# EAGLE design max30105 (EAGLE 7.7.0)
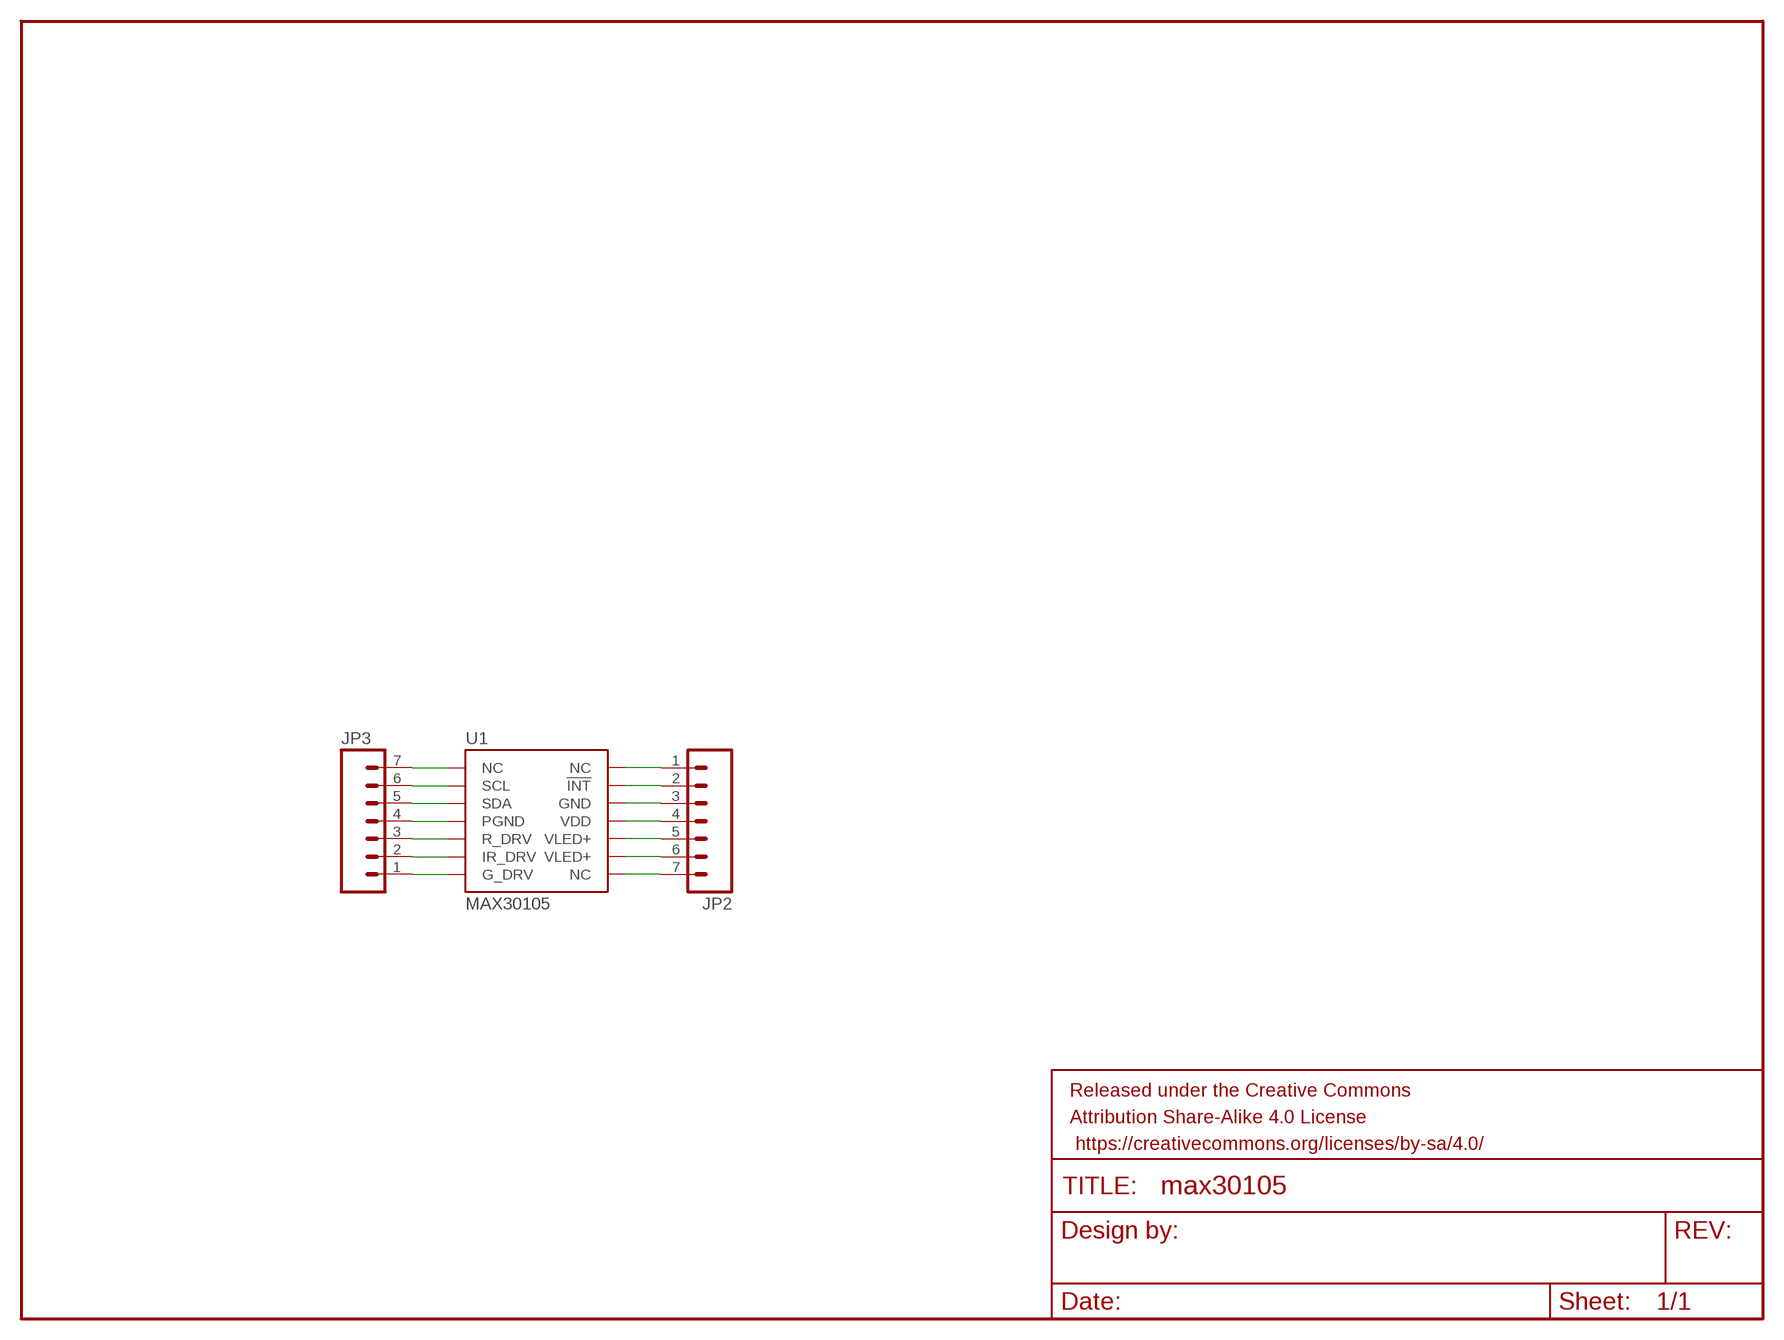
[diagram p0: schematic, sheet 1]

## Parts
FRAME1  FRAME-LETTER  [CREATIVE_COMMONS]
JP2  M07  [1X07]
JP3  M07  [1X07]
U1  MAX30105  MAX30105SMD  [OLGA-14]

## Nets
N$1: JP2.1 U1.14(NC)
N$2: JP2.2 U1.13(!INT)
N$3: JP2.3 U1.12(GND)
N$4: JP2.4 U1.11(VDD)
N$5: JP2.5 U1.10(VLED+)
N$6: JP2.6 U1.9(VLED+)
N$7: JP2.7 U1.8(NC)
N$8: JP3.1 U1.7(G_DRV)
N$9: JP3.2 U1.6(IR_DRV)
N$10: JP3.3 U1.5(R_DRV)
N$11: JP3.4 U1.4(PGND)
N$12: JP3.5 U1.3(SDA)
N$13: JP3.6 U1.2(SCL)
N$14: JP3.7 U1.1(NC)

## Library data of the parts
FRAME1 = SparkFun-Aesthetics:FRAME-LETTER: Schematic Frame Standard 8.5x11 US Letter frame
JP2 JP3 = SparkFun-Connectors:M07: Header 7 Standard 7-pin 0.1" header. Use with straight break away headers (SKU : PRT-00116), right angle break away headers (PRT-00553), swiss pins (PRT-00743), machine pins (PRT-00117), and female headers (PRT-00115). NOTES ON THE VARIANTS LOCK and LOCK_LONGPADS... This footprint was designed to help hold the alignment of a through-hole component (i.e. 7-pin header) while soldering it into place. You may notice that each hole has been shifted either up or down by 0.005 of an inch from it's more standard position (which is usually a perfectly straight line). This slight alteration caused the pins (the squares in the middle) to touch the edges of the holes. Because they are alternating, it causes a "brace" to hold the header in place. 0.005 has proven to be the perfect amount of "off-center" position when using our standard breakaway headers. Although looks a little odd when you look at the bare footprint, once you have a header in there, the alteration is very hard to notice. Also, if you push a header all the way into place, it is covered up entirely on the bottom side. This idea of altering the position of holes to aid alignment will be further integrated into the Sparkfun Library for other footprints. It can help hold any component with 3 or more connection pins.
U1 = MAX30105-Sensor:MAX30105: Description: Particle Detection IC. Primarily used for smoke detection, can be used for Pulse Detection, Pulse Ox, and possible visual particle detection.; PROD_ID: IC-13510

## Net classes
1 power: width 0.203 mm

## Board
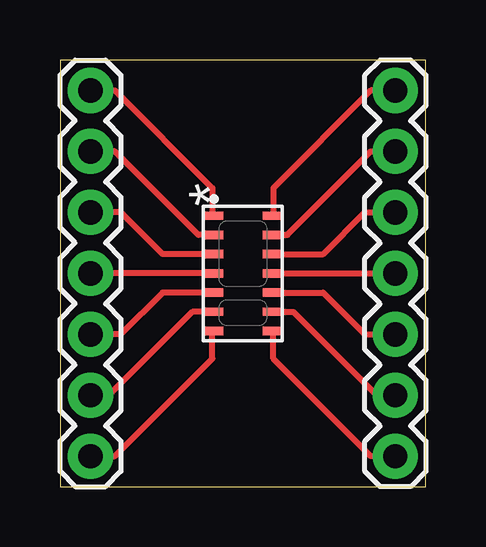
[diagram p1: board, top side]

Size 15.24 x 17.78 mm. Coordinates in mm from the lower left corner, seen from the top.
Outline: 0,0 15.24,0 15.24,17.78 0,17.77 0,0
Copper layers (1*16): Top 0.035mm / dielectric 1.5mm / Bottom 0.035mm
Design rules "default": minimum track width 10mil, minimum drill 24mil, track to track 8mil, track to pad 8mil, pad to pad 8mil, via to via 8mil, smd to smd 8mil, copper to edge 40mil, drill to drill 8mil, minimum pad ring 10mil, minimum via ring 8mil, stop-mask expansion 4mil, vias tented up to drill 0mil, thermal gap 10mil

### Footprints (pad centres in the part's own frame; a part is rotated, then mirrored left to right if it is on the bottom)
1X07 = drill 1.016 pad 1.88: 1 0,0; 2 2.54,0; 3 5.08,0; 4 7.62,0; 5 10.16,0; 6 12.7,0; 7 15.24,0
OLGA-14 = smd 0.75 x 0.35: 1 -1.2,2.4; 2 -1.2,1.6; 3 -1.2,0.8; 4 -1.2,0; 5 -1.2,-0.8; 6 -1.2,-1.6; 7 -1.2,-2.4; 8 1.2,-2.4; 9 1.2,-1.6; 10 1.2,-0.8; 11 1.2,0; 12 1.2,0.8; 13 1.2,1.6; 14 1.2,2.4

### Placement (x,y rotation side)
FRAME1  -101.6,1.27 0 top  (outside the outline)
JP2  13.97,16.51 270 top
JP3  1.27,1.27 90 top
U1  7.62,8.89 0 top

### Tracks (layer width: path | path; a pad name or v marks a point on that pad's centre or on a via)
N$1
  Top 0.254: JP2.1 12.95,16.51 8.89,12.45 8.89,11.36 U1.14
N$2
  Top 0.254: U1.13 9.47,10.49 12.95,13.97 JP2.2
N$3
  Top 0.254: U1.12 10.96,9.69 12.7,11.43 JP2.3
N$4
  Top 0.254: U1.11 JP2.4
N$5
  Top 0.254: U1.10 10.96,8.09 12.7,6.35 JP2.5
N$6
  Top 0.254: U1.9 9.73,7.29 13.21,3.81 JP2.6
N$7
  Top 0.254: JP2.7 12.95,1.27 8.89,5.33 8.89,6.42 U1.8
N$8
  Top 0.254: JP3.1 2.29,1.27 6.35,5.33 6.35,6.42 U1.7
N$9
  Top 0.254: U1.6 5.51,7.29 2.03,3.81 JP3.2
N$10
  Top 0.254: U1.5 4.28,8.09 2.54,6.35 JP3.3
N$11
  Top 0.254: U1.4 JP3.4
N$12
  Top 0.254: U1.3 4.28,9.69 2.54,11.43 JP3.5
N$13
  Top 0.254: U1.2 5.77,10.49 2.29,13.97 JP3.6
N$14
  Top 0.254: JP3.7 2.29,16.51 6.35,12.45 6.35,11.36 U1.1

### Text on the board
tPlace: *